# EAGLE design ECE3400Treasure (EAGLE 8.0.1)
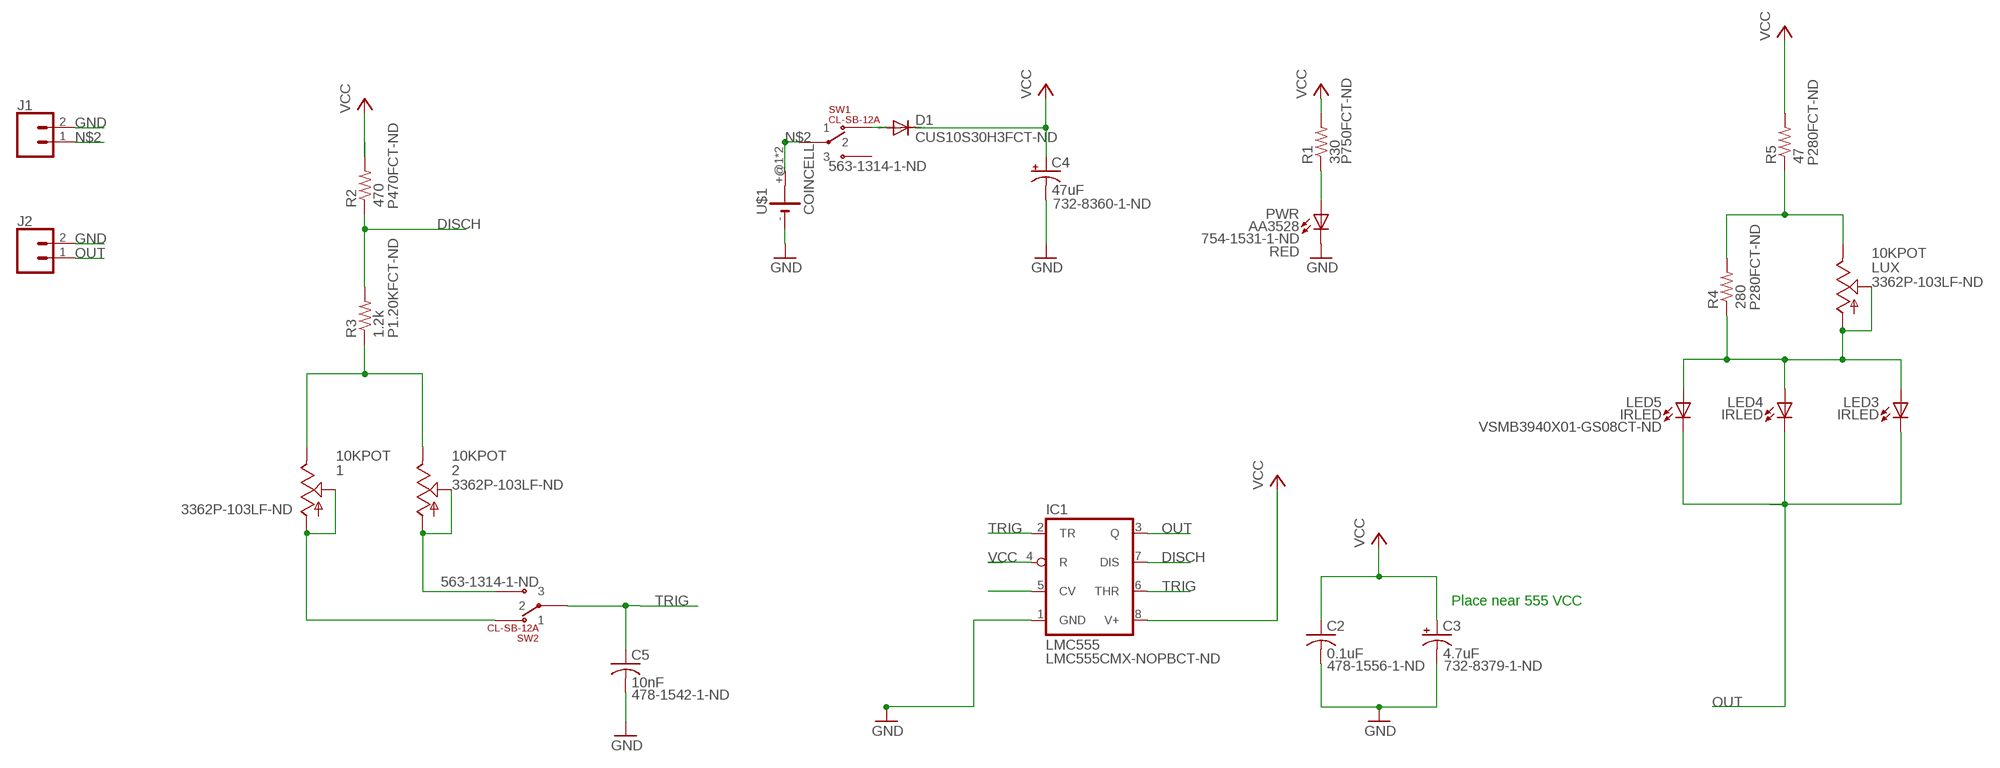
[diagram p0: schematic, sheet 1]

## Parts
1  10KPOT  [POT]
2  10KPOT  [POT]
C2  0.1uF  C-USC1206  [C1206]
C3  4.7uF  CPOL  [UD-6,6X6,6]
C4  47uF  CPOL  [UD-6,6X6,6]
C5  10nF  C-USC1206  [C1206]
D1  DIODE-SOD323-R  [SOD323-R]
IC1  LMC555  LM555D  [SO08]
J1  CONN_02  [1X02]
J2  CONN_02  [1X02]
LED3  IRLED  [2-SMD]
LED4  IRLED  [2-SMD]
LED5  IRLED  [2-SMD]
LUX  10KPOT  [POT]
PWR  AA3528  [2-PLCC]
R1  330  R-US_R1206  [R1206]
R2  470  R-US_R1206  [R1206]
R3  1.2k  R-US_R1206  [R1206]
R4  280  R-US_R1206  [R1206]
R5  47  R-US_R1206  [R1206]
SW1  CL-SB-12A  [CL-SB-12A]
SW2  CL-SB-12A  [CL-SB-12A]
U$1  COINCELL  [COINCELL]

## Nets
DISCH: IC1.7(DIS) R2.1 R3.2
GND: C2.2 C3.- C4.- C5.2 IC1.1(GND) J1.2 J2.2 PWR.P$2(C) U$1.-
N$1: PWR.P$1(A) R1.1
N$2: J1.1 SW1.1 U$1.+@1(+) U$1.+@2(+)
N$3: D1.A SW1.2
N$4: 2.P$1(A) 2.P$2(S) SW2.3
N$5: 1.P$1(A) 1.P$2(S) SW2.2
N$6: 1.P$3(E) 2.P$3(E) R3.1
N$8: LED3.P$1(A) LED4.P$1(A) LED5.P$1(A) LUX.P$1(A) LUX.P$2(S) R4.1
N$9: LUX.P$3(E) R4.2 R5.1
N$10: IC1.5(CV)
OUT: IC1.3(Q) J2.1 LED3.P$2(C) LED4.P$2(C) LED5.P$2(C)
TRIG: C5.1 IC1.2(TR) IC1.6(THR) SW2.1
VCC: C2.1 C3.+ C4.+ D1.C IC1.4(R) IC1.8(V+) R1.2 R2.2 R5.2
Unconnected: SW1.3

## Notes on the sheet
- Place near 555 VCC

## Library data of the parts
1 2 LUX = clc288:10KPOT; DGPN: 3362P-103LF-ND
C2 = rcl:C-US: CAPACITOR, American symbol; DGPN: 478-1556-1-ND
C3 = clc288:CPOL; DGPN: 732-8379-1-ND
C4 = clc288:CPOL; DGPN: 732-8360-1-ND
C5 = rcl:C-US: CAPACITOR, American symbol; DGPN: 478-1542-1-ND
D1 = diode:DIODE-: DIODE; DGPN: CUS10S30H3FCT-ND
IC1 = linear:*555: TIMER; DGPN: LMC555CMX-NOPBCT-ND
J1 J2 = SparkFun-Connectors:CONN_02: Multi connection point. Often used as Generic Header-pin footprint for 0.1 inch spaced/style header connections On any of the 0.1 inch spaced packages, you can populate with these: Break Away Headers - Straight <https://www.sparkfun.com/products/116> (PRT-00116) Break Away Male Headers - Right Angle <https://www.sparkfun.com/products/553> (PRT-00553) Female Headers <https://www.sparkfun.com/products/115> (PRT-00115) Break Away Headers - Machine Pin <https://www.sparkfun.com/products/117> (PRT-00117) Break Away Female Headers - Swiss Machine Pin <https://www.sparkfun.com/products/743> (PRT-00743) For SCREWTERMINALS and SPRING TERMINALS visit here: Screw Terimnals on SparkFun.com <https://www.sparkfun.com/search/results?term=Screw+Terminals> (5mm/3.5mm/2.54mm spacing) This device is also useful as a general connection point to wire up your design to another part of your project. Our various solder wires solder well into these plated through hole pads. Hook-Up Wire - Assortment (Stranded, 22 AWG) <https://www.sparkfun.com/products/11375> (PRT-11375) Hook-Up Wire - Assortment (Solid Core, 22 AWG) <https://www.sparkfun.com/products/11367> (PRT-11367) View the entire wire category on our website here <https://www.sparkfun.com/categories/141> Special notes: Molex polarized connector foot print use with: PRT-08233 with associated crimp pins and housings. 2.54_SCREWTERM for use with PRT-10571. 3.5mm Screw Terminal footprints for PRT-08084 5mm Screw Terminal footprints for use with PRT-08432
LED3-LED5 = clc288:IRLED; DGPN: VSMB3940X01-GS08CT-ND
PWR = clc288:AA3528; COLOR: RED; DGPN: 754-1531-1-ND
R1 = rcl:R-US_: RESISTOR, American symbol; DGPN: P750FCT-ND
R2 = rcl:R-US_: RESISTOR, American symbol; DGPN: P470FCT-ND
R3 = rcl:R-US_: RESISTOR, American symbol; DGPN: P1.20KFCT-ND
R4 R5 = rcl:R-US_: RESISTOR, American symbol; DGPN: P280FCT-ND
SW1 SW2 = clc288:CL-SB-12A; DGPN: 563-1314-1-ND
U$1 = clc288:COINCELL

## Board
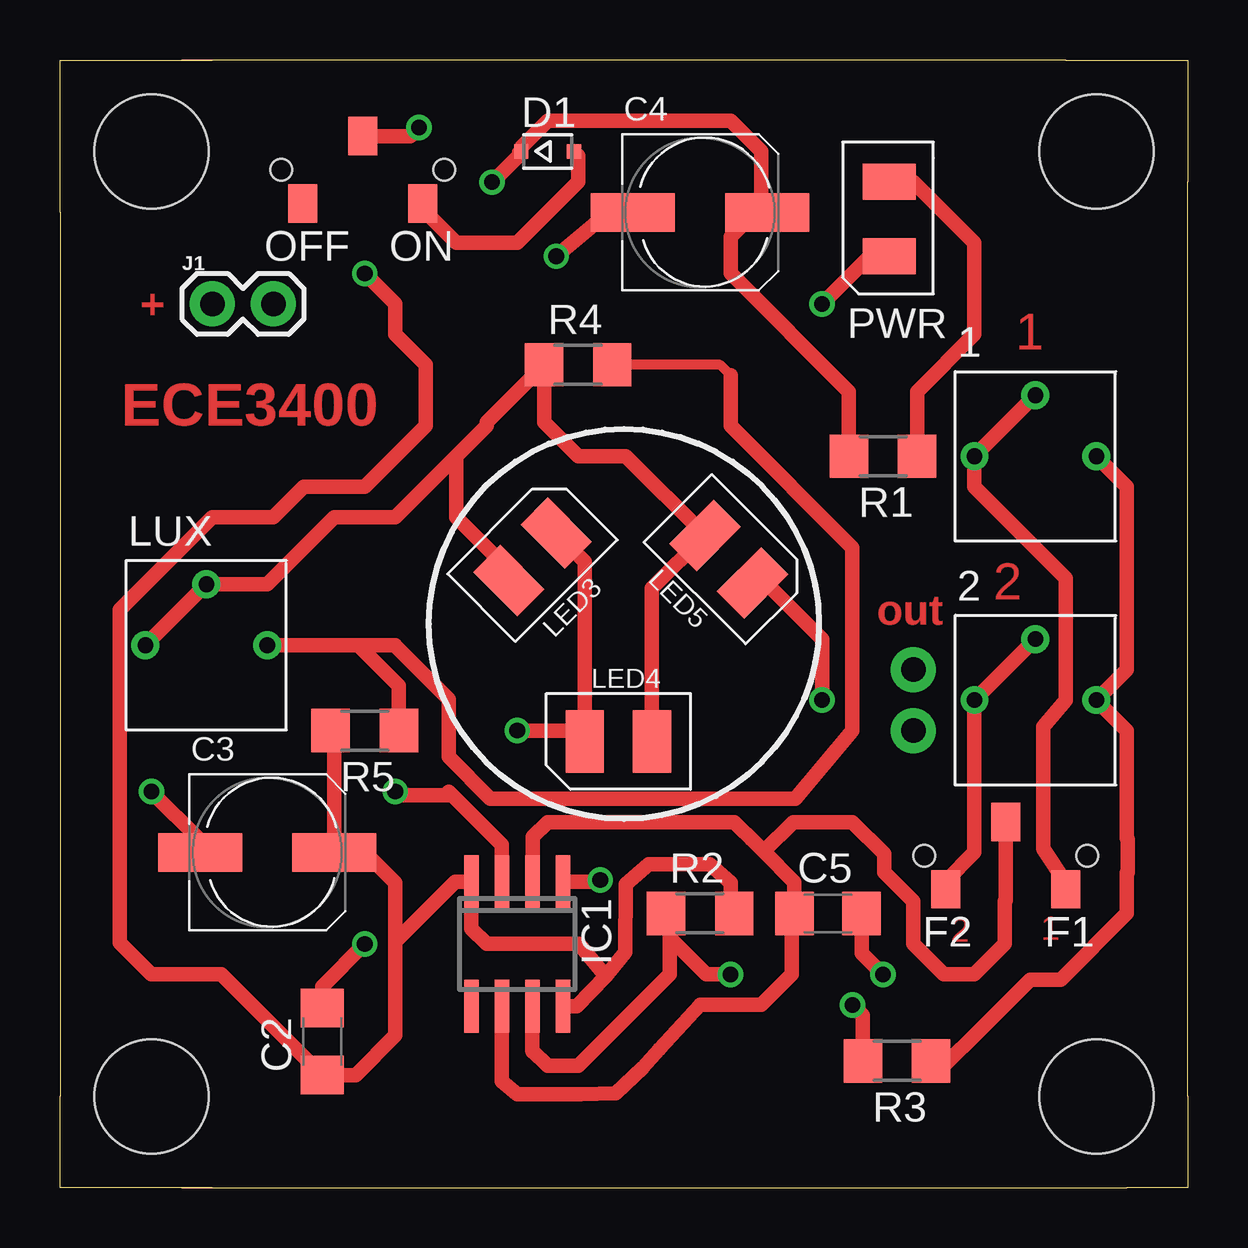
[diagram p1: board, top side]
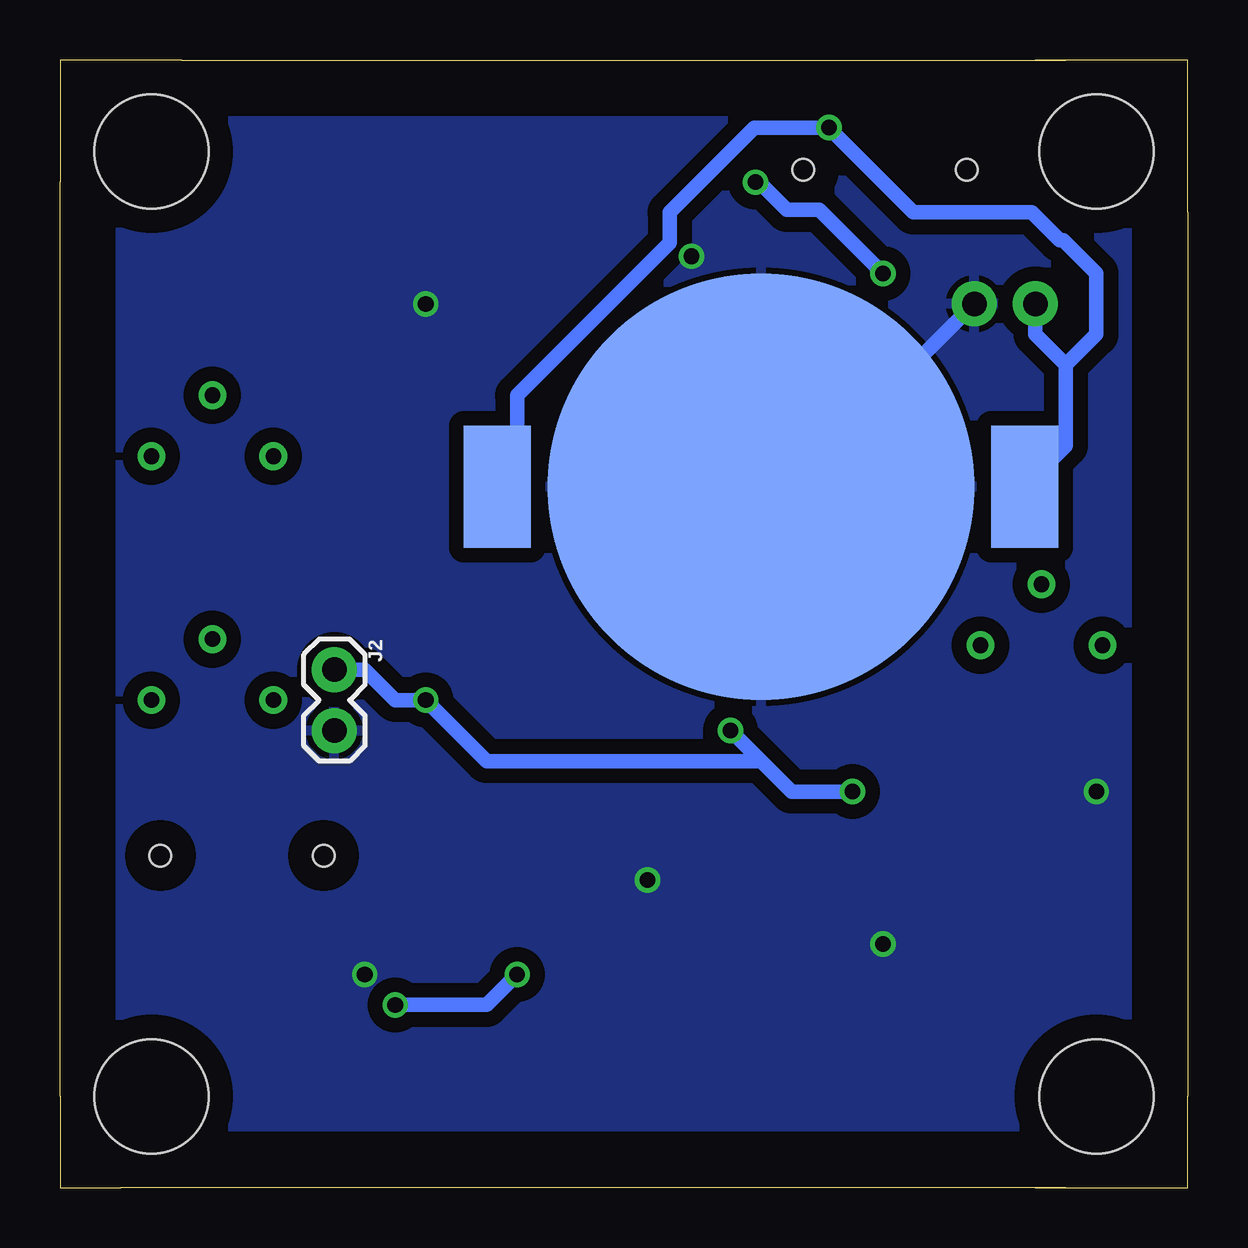
[diagram p2: board, bottom side, seen from below]

Size 46.99 x 46.99 mm. Coordinates in mm from the lower left corner, seen from the top.
Outline: 5.08,0 6.35,0
Outline: 6.35,0 41.91,0 44.45,0 46.99,0 46.99,3.81 46.99,41.91 46.99,46.99 45.72,46.99 41.91,46.99 6.35,46.99
Outline: 6.35,46.99 5.08,46.99
Outline: 6.35,0 5.08,0
Outline: 6.35,46.99 0,46.99 0,40.64 0,3.81 0,0 5.08,0
Copper layers (1*16): Top 0.035mm / dielectric 1.5mm / Bottom 0.035mm
Design rules "default *": minimum track width 6mil, minimum drill 0.35mm, track to track 6mil, track to pad 6mil, pad to pad 6mil, via to via 6mil, smd to smd 6mil, copper to edge 40mil, drill to drill 6mil, minimum pad ring 10mil, minimum via ring 8mil, stop-mask expansion 10mil, vias tented up to drill 0mil, thermal gap 10mil
Holes 4.75 mm at 3.81,3.81 43.18,3.81 43.18,43.18 3.81,43.18

### Footprints (pad centres in the part's own frame; a part is rotated, then mirrored left to right if it is on the bottom)
POT = drill 0.65: P$1 -2.54,0; P$2 0,2.54; P$3 2.54,0
C1206 = smd 1.6 x 1.8: 1 -1.4,0; 2 1.4,0
UD-6,6X6,6 = smd 3.5 x 1.6: + 2.8,0; - -2.8,0
SOD323-R = smd 0.6 x 0.6: A 1.1,0; C -1.1,0
SO08 = smd 0.6 x 2.2: 1 -1.905,-2.6; 2 -0.635,-2.6; 3 0.635,-2.6; 4 1.905,-2.6; 5 1.905,2.6; 6 0.635,2.6; 7 -0.635,2.6; 8 -1.905,2.6
1X02 = drill 1.016 pad 1.88: 1 0,0; 2 2.54,0
2-SMD = smd 1.6 x 2.6: P$1 1.4,0; P$2 -1.4,0
2-PLCC = smd 1.5 x 2.2: P$1 1.55,0; P$2 -1.55,0
R1206 = smd 1.6 x 1.803: 1 -1.422,0; 2 1.422,0
CL-SB-12A = smd 1.2 x 1.6: 1 0,1.4; 2 2.5,-1.4; 3 -2.5,-1.4 | hole 0.9: 3.4,0; -3.4,0
COINCELL = smd 2.79 x 5.08: +@1 -10.99,0; +@2 10.99,0 | smd 17.78 x 17.78: - 0,0

### Placement (x,y rotation side)
1  40.64,30.48 0 top
2  40.64,20.32 0 top
C2  10.92,6.1 90 top
C3  8.64,13.97 0 top
C4  26.67,40.64 0 top
C5  32,11.43 0 top
D1  20.32,43.18 0 top
IC1  19.05,10.16 180 top
J1  6.35,36.83 0 top
J2  35.56,21.59 270 bottom
LED3  19.68,26.29 225 top
LED4  23.26,18.59 0 top
LED5  27.87,26.19 135 top
LUX  6.1,22.61 0 top
PWR  34.55,40.36 90 top
R1  34.29,30.48 180 top
R2  26.67,11.43 0 top
R3  34.87,5.28 180 top
R4  21.59,34.29 0 top
R5  12.7,19.05 180 top
SW1  12.61,42.42 0 top
SW2  39.41,13.84 0 top
U$1  17.78,29.21 180 bottom

### Tracks (layer width: path | path; a pad name or v marks a point on that pad's centre or on a via)
DISCH  (via drill 0.65)
  Top 0.406: 25.4,11.28 R2.1
  Top 0.61: IC1.7 19.68,5.71 | 19.68,5.71 19.71,5.64 | R3.2 33.45,7.19 v33.02,7.62 | 19.68,5.71 20.32,5.08 21.59,5.08 25.4,8.89 25.4,10.42 | 25.4,10.42 25.4,11.28 | v27.94,8.89 26.93,8.89 25.4,10.42
  Bottom 0.61: v27.94,8.89 29.21,7.62 v33.02,7.62
GND  (via drill 0.65)
  Top 0.406: C3.- 5.84,14.48 | 22.63,12.76 v22.51,12.83 | C4.- 22.86,40.64 | PWR.P$2 33.73,38.81
  Top 0.61: 5.84,14.48 v3.81,16.51 | IC1.1 22.63,12.76 | 22.86,40.64 v20.68,38.81 | 33.73,38.81 v31.75,36.83 | C5.2 33.4,9.78 v34.29,8.89 | v12.7,10.16 10.92,8.38 C2.2
  Bottom 0.61: J1.2 11.43,34.29 12.7,34.29 U$1.-
  pour Bottom (isolate 0.61): 7.62,2.54 41.91,2.54 arc90 44.45,5.08 44.45,8.89 44.45,41.91 arc90 41.91,44.45 39.37,44.45 6.35,44.45 arc90 2.54,40.64 2.54,38.1 2.54,5.08 arc90 5.08,2.54
N$1
  Top 0.406: 35.56,41.91 PWR.P$1
  Top 0.61: R1.1 35.71,33.17 38.1,35.56 38.1,39.37 35.56,41.91
N$2  (via drill 0.65)
  Top 0.61: SW1.1 14.59,43.82 v14.95,44.18
  Bottom 0.406: 6.35,29.65 6.68,29.32 U$1.+@1 | 27.94,30.04 U$1.+@2
  Bottom 0.61: 27.94,30.04 27.94,33.02 21.59,39.37 21.59,40.64 18.05,44.18 v14.95,44.18 14.95,44.16 11.43,40.64 6.5,40.64 5.34,39.48 5.19,39.48 3.81,38.1 3.81,35.56 5.08,34.29 | 5.08,34.29 5.08,30.92 6.68,29.32 | J1.1 6.35,35.56 5.08,34.29
N$3
  Top 0.61: D1.A 21.59,43.01 21.59,41.91 19.05,39.37 16.51,39.37 15.11,40.77 SW1.2
N$4
  Top 0.406: SW2.3 36.91,12.78
  Top 0.61: 2.P$2 2.P$1 38.1,13.97 36.91,12.78
N$5
  Top 0.406: SW2.2 41.91,12.7
  Top 0.61: 1.P$2 1.P$1 38.1,29.21 41.91,25.4 41.91,20.32 40.97,19.2 40.97,14.12 41.91,12.7
N$6
  Top 0.406: 44.45,14.56 44.48,14.53 | 44.48,13.15 44.45,13.12 | 38.32,6.57 | 36.83,5.08 36.5,5.08 R3.1
  Top 0.61: 1.P$3 44.45,29.21 44.45,21.59 2.P$3 44.45,19.05 44.45,14.56 | 44.48,14.53 44.48,13.15 | 44.45,13.12 44.45,11.43 41.69,8.67 40.42,8.67 38.32,6.57 | 38.32,6.57 36.83,5.08
N$8
  Top 0.406: 20.32,34.14 R4.1
  Top 0.61: LUX.P$1 LUX.P$2 8.64,25.15 11.43,27.94 13.97,27.94 17.78,31.75 | 17.78,31.75 17.78,31.9 R4.1 20.17,31.9 21.59,30.48 23.58,30.48 LED5.P$1 | LED4.P$1 24.66,24.97 LED5.P$1 | LED5.P$1 26.88,27.58 | LED3.P$1 18.7,25.75 16.51,27.94 16.51,30.48 17.78,31.75
N$9
  Top 0.406: R4.2 27.5,34.29 27.94,33.85 | 13.97,22.61 13.99,22.55 13.97,22.61
  Top 0.61: 12.42,22.61 LUX.P$3 | 12.42,22.61 13.97,22.61 | 27.94,33.85 27.94,31.75 33.02,26.67 33.02,19.05 30.63,16.21 17.93,16.21 16.21,17.96 16.21,20.34 13.99,22.55 | R5.1 14.12,20.91 12.42,22.61
OUT  (via drill 0.65)
  Top 0.152: 15.24,16.35 16.04,16.35 16.2,16.51
  Top 0.61: IC1.3 18.41,14.29 16.2,16.51 | 16.35,16.35 15.24,16.35 14.13,16.35 v13.97,16.51 | v31.75,20.32 31.75,22.86 29.21,25.4 29.05,25.4 LED5.P$2 | LED3.P$2 21.86,26.09 LED4.P$2 21.41,19.05 v19.05,19.05
  Bottom 0.61: v13.97,16.51 16.51,16.51 17.78,17.78 | 17.78,17.78 29.21,17.78 v31.75,20.32 33.02,20.32 34.29,21.59 J2.1 | 17.78,17.78 v19.05,19.05
TRIG
  Top 0.406: IC1.2 19.69,13.25 19.69,12.79 | 28.81,14.53 28.85,14.53 | 30.48,11.31 C5.1 | 39.41,11.98 39.41,11.47
  Top 0.61: 19.69,12.79 19.7,13.96 | 19.7,13.96 19.7,14.5 | IC1.6 18.41,4.45 19.05,3.89 21.69,3.89 23.16,3.94 24.28,5 24.97,5.77 26.67,7.62 29.21,7.62 30.48,8.89 30.48,11.31 | C5.1 30.6,12.73 29.32,14.01 | 29,14.34 29.32,14.01 | 29,14.34 28.81,14.53 | SW2.1 39.41,11.98 39.37,11.94 39.37,10.16 38.1,8.89 36.83,8.89 35.56,10.16 35.56,11.93 34.34,13.15 34.34,13.92 33.02,15.24 30.55,15.24 29.32,14.01 | 19.7,13.96 19.7,14.62 20.32,15.24 28.1,15.24 29,14.34
VCC  (via drill 0.65)
  Top 0.152: 11.44,18.89 R5.2
  Top 0.406: 27.94,11.58 R2.2 | 19.05,43.18 D1.C | D1.C 19.22,43.35 | 29.21,40.9 C4.+ | 12.7,13.97 C3.+ | D1.C 19.22,43.11 | 27.94,12.67 27.94,12.7 27.94,12.67
  Top 0.61: IC1.8 21.53,7.56 22.75,8.82 | 27.94,12.67 27.94,11.58 | 22.75,8.82 23.55,9.8 23.57,12.65 24.54,13.49 27.08,13.49 27.94,12.7 | 19.22,43.35 20.32,44.45 27.94,44.45 29.21,43.18 29.21,40.9 27.94,39.63 27.94,38.1 32.87,33.17 R1.2 | 13.97,10.25 13.97,6.35 12.32,4.7 C2.1 6.73,8.89 3.81,8.89 2.49,10.21 2.49,24.08 6.35,27.94 8.89,27.94 10.16,29.21 12.7,29.21 15.24,31.75 15.24,34.29 13.97,35.56 13.97,36.83 v12.7,38.1 | 13.97,10.25 13.97,12.7 12.7,13.97 | 13.97,10.25 16.48,12.76 IC1.4 17.14,10.79 17.78,10.16 21.61,10.16 22.75,8.82 | 19.22,43.11 v18.01,41.9 | C3.+ 11.44,18.89
  Bottom 0.406: v18.01,41.9 17.86,41.9
  Bottom 0.61: v12.7,38.1 15.35,40.75 16.7,40.75 17.86,41.9

### Text on the board
Top: + | 1 | ECE3400 | 2 | out | 2 | 1
tPlace: OFF | ON | F2 | F1